# Altium project TK104_Pulsbegrenser_Eurorack_frontpanel.PrjPCB
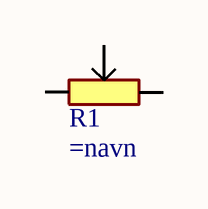
[diagram p0: TK104_Pulsbegrenser_Eurorack_frontpanel.SchDoc]
1 sheet, 1 parts. Net scope: global (net labels, ports and power ports of the same name join across sheets).
Board file: TK104_Pulsbegrenser_Eurorack_frontpanel.PcbDoc

## Sheet TK104_Pulsbegrenser_Eurorack_frontpanel.SchDoc
size A3; Revision: 6

### Parts
R1  (no value)  [PTA4543-PANEL]

### Nets

Not connected (* = marked no-connect by the designer): R1 1 2 3

### Notes on the sheet
- Size:
- Date:
- Title:
- A3
- Revision:
- Sheet
- of
- Author:
- File:

### Library data of the parts
R1 = Potmeter